# Altium schematic sheet Sheet1.SchDoc
size A; SheetNumber: 2; SheetTotal: 4
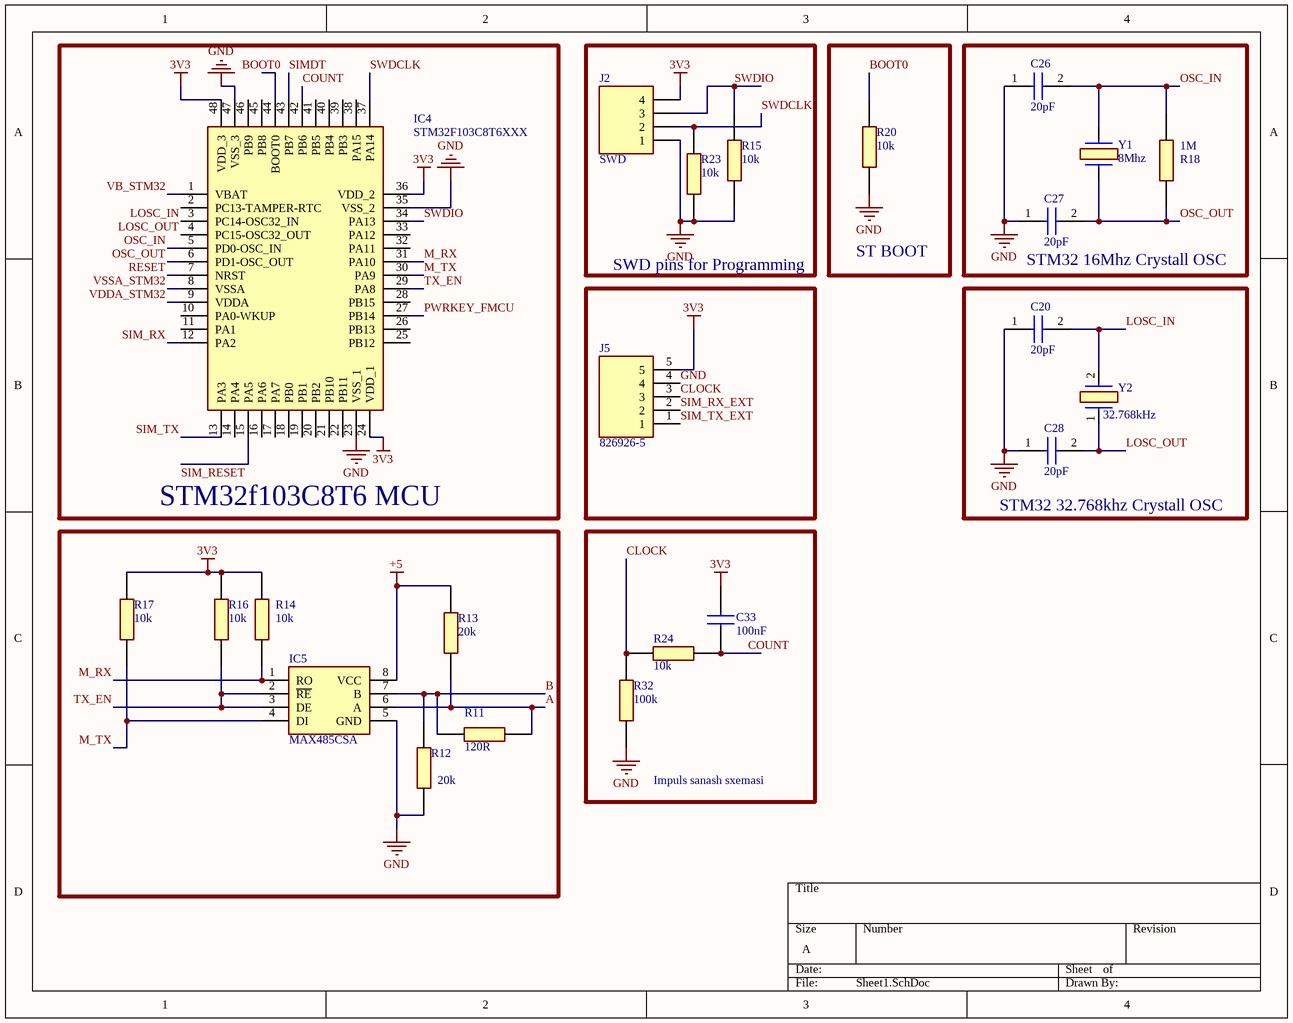
[diagram p0: Sheet1.SchDoc]

## Parts
C20  20pF  [C0603]
C26  20pF  [C0603]
C27  20pF  [C0603]
C28  20pF  [C0603]
C33  100nF  [CAPC1608X90N]
IC4  STM32F103C8T6XXX  [QFP50P900X900X160-48N]
IC5  MAX485CSA  [SOIC127P600X175-8N]
J2  SWD  [9298340704]
J5  826926-5  [HDRV5W85P0X254_1X5_1270X250X950P]
R11  120R  [RESC2012X60N]
R12  20k  [RESC2012X60N]
R13  20k  [RESC2012X60N]
R14  10k  [RESC2012X60N]
R15  10k  [RESC2012X60N]
R16  10k  [RESC2012X60N]
R17  10k  [RESC2012X60N]
R18  1M  [RESC1608X55N]
R20  10k  [RESC2012X60N]
R23  10k  [RESC2012X60N]
R24  10k  [RESC2012X60N]
R32  100k  [RESC2012X60N]
Y1  8Mhz  [830003151]
Y2  32.768kHz  [ABS06]

## Blocks framed on the sheet
SWD pins for Programming: J2 R15 R23
ST BOOT: R20
STM32 16Mhz Crystall OSC: C26 C27 R18 Y1
STM32 32.768khz Crystall OSC: C20 C28 Y2
STM32f103C8T6 MCU: IC5 R11-R14 R16 R17
Impuls sanash sxemasi: C33 R24 R32

## Nets
3V3: C33.2 IC4.24(VDD_1) IC4.36(VDD_2) IC4.48(VDD_3) J2.4 J5.5 R14.2 R16.2 R17.2
+5: IC5.8(VCC) R13.2
GND: C20.1 C26.1 C27.1 C28.1 IC4.23(VSS_1) IC4.35(VSS_2) IC4.47(VSS_3) IC5.5(GND) J2.1 J5.4 R12.1 R15.1 R20.1 R23.1 R32.1
A: IC5.6(A) R11.2 R13.1
B: IC5.7(B) R11.1 R12.2
BOOT0: IC4.44(BOOT0) R20.2
CLOCK: J5.3 R24.2 R32.2
COUNT: C33.1 IC4.42(PB6) R24.1
LOSC_IN: C20.2 IC4.3(PC14-OSC32_IN) Y2.2
LOSC_OUT: C28.2 IC4.4(PC15-OSC32_OUT) Y2.1
M_RX: IC4.31(PA10) IC5.1(RO) R14.1
M_TX: IC4.30(PA9) IC5.4(DI) R17.1
OSC_IN: C26.2 IC4.5(PD0-OSC_IN) R18.2 Y1.1
OSC_OUT: C27.2 IC4.6(PD1-OSC_OUT) R18.1 Y1.2
PWRKEY_FMCU: IC4.27(PB14)
RESET: IC4.7(NRST)
SIM_RESET: IC4.15(PA5)
SIM_RX: IC4.12(PA2)
SIM_RX_EXT: J5.2
SIM_TX: IC4.13(PA3)
SIM_TX_EXT: J5.1
SIMDT: IC4.43(PB7)
SWDCLK: IC4.37(PA14) J2.2 R23.2
SWDIO: IC4.34(PA13) J2.3 R15.2
TX_EN: IC4.29(PA8) IC5.2(~{RE}) IC5.3(DE) R16.1
VB_STM32: IC4.1(VBAT)
VDDA_STM32: IC4.9(VDDA)
VSSA_STM32: IC4.8(VSSA)

Not connected (* = marked no-connect by the designer): IC4 2(PC13-TAMPER-RTC) 10(PA0-WKUP) 11(PA1) 14(PA4) 16(PA6) 17(PA7) 18(PB0) 19(PB1) 20(PB2) 21(PB10) 22(PB11) 25(PB12) 26(PB13) 28(PB15) 32(PA11) 33(PA12) 38(PA15) 39(PB3) 40(PB4) 41(PB5) 45(PB8) 46(PB9)

## Library data of the parts
C20 C26-C28 = C0603C200G8HACTU: Capacitor; Manufacturer_Name: KEMET; Datasheet Link: https://content.kemet.com/datasheets/KEM_C1007_X8R_ULTRA_150C_SMD.pdf; Height: 0.87mm; Manufacturer_Part_Number: C0603C200G8HACTU; Mouser Part Number: 80-C0603C200G8HACTU; Mouser Price/Stock: https://www.mouser.co.uk/ProductDetail/KEMET/C0603C200G8HACTU?qs=W0yvOO0ixfFF9ypbpYI35Q%3D%3D
C33 = 06036C104MAZ2A: Capacitor; Manufacturer_Name: AVX; Datasheet Link: https://componentsearchengine.com/Datasheets/1/06031A100FAT2A.pdf; Height: 0.9mm; Manufacturer_Part_Number: 06036C104MAZ2A; Mouser Part Number: 581-06036C104MAZ2A; Mouser Price/Stock: https://www.mouser.co.uk/ProductDetail/AVX/06036C104MAZ2A?qs=9g9l2Gjnh0s%2FYval7p6%252B1g%3D%3D; Arrow Part Number: 06036C104MAZ2A; Arrow Price/Stock: https://www.arrow.com/en/products/06036c104maz2a/avx
IC4 = STM32F103C8T6XXX: Integrated Circuit; Manufacturer_Name: ST; Height: 1.6mm; Manufacturer_Part_Number: STM32F103C8T6XXX
IC5 = MAX485CSA: Integrated Circuit; Manufacturer_Name: Analog Devices; Datasheet Link: https://datasheets.maximintegrated.com/en/ds/MAX1487-MAX491.pdf; Height: 1.75mm; Manufacturer_Part_Number: MAX485CSA; Mouser Part Number: N/A; Mouser Price/Stock: https://www.mouser.co.uk/ProductDetail/Maxim-Integrated/MAX485CSA?qs=LHmEVA8xxfbb%2FSUlm%252BHF3Q%3D%3D
J2 = 929834-07-04: Connector; Manufacturer_Name: 3M; Datasheet Link: https://www.mouser.ca/datasheet/2/1/ts0769-35914.pdf; Height: 8.713mm; Manufacturer_Part_Number: 929834-07-04; Mouser Part Number: 517-929834-07-04; Mouser Price/Stock: https://www.mouser.com/Search/Refine.aspx?Keyword=517-929834-07-04
J5 = 826926-5: Connector; Manufacturer_Name: TE Connectivity; Datasheet Link: http://uk.rs-online.com/web/p/products/6695323; Height: 9.5mm; Manufacturer_Part_Number: 826926-5; Mouser Part Number: 571-826926-5; Mouser Price/Stock: https://www.mouser.co.uk/ProductDetail/TE-Connectivity/826926-5?qs=wMzmFFBcbXS4DfsolxXR2g%3D%3D; Arrow Part Number: 826926-5; Arrow Price/Stock: https://www.arrow.com/en/products/826926-5/te-connectivity?region=europe
R11 = CR0805-JW-121ELF: Resistor; Manufacturer_Name: Bourns; Datasheet Link: https://www.bourns.com/pdfs/chpreztr.pdf; Height: 0.6mm; Manufacturer_Part_Number: CR0805-JW-121ELF; Mouser Part Number: 652-CR0805JW-121ELF; Mouser Price/Stock: https://www.mouser.co.uk/ProductDetail/Bourns/CR0805-JW-121ELF?qs=wL7NMIHXUPnmcuStpLOKew%3D%3D; Arrow Part Number: CR0805-JW-121ELF; Arrow Price/Stock: https://www.arrow.com/en/products/cr0805-jw-121elf/bourns?region=nac
R12 R13 = CR0805-FX-2002ELF: Resistor; Manufacturer_Name: Bourns; Datasheet Link: https://www.bourns.com/pdfs/chpreztr.pdf; Height: 0.6mm; Manufacturer_Part_Number: CR0805-FX-2002ELF; Mouser Part Number: 652-CR0805FX-2002ELF; Mouser Price/Stock: https://www.mouser.co.uk/ProductDetail/Bourns/CR0805-FX-2002ELF?qs=mEbcl8R%252Bl%252Bv8rqM1zQjjRA%3D%3D; Arrow Part Number: CR0805-FX-2002ELF; Arrow Price/Stock: https://www.arrow.com/en/products/cr0805-fx-2002elf/bourns?region=nac
R14-R17 R20 R23 R24 = CR0805-FX-1002ELF: Resistor; Manufacturer_Name: Bourns; Datasheet Link: https://www.bourns.com/pdfs/chpreztr.pdf; Height: 0.6mm; Manufacturer_Part_Number: CR0805-FX-1002ELF; Mouser Part Number: 652-CR0805FX-1002ELF; Mouser Price/Stock: https://www.mouser.co.uk/ProductDetail/Bourns/CR0805-FX-1002ELF?qs=tknLyCMIRbPr%252BDD0s0nG9g%3D%3D; Arrow Part Number: CR0805-FX-1002ELF; Arrow Price/Stock: https://www.arrow.com/en/products/cr0805-fx-1002elf/bourns?region=nac
R18 = CR0603-FX-1004ELF: Resistor; Manufacturer_Name: Bourns; Datasheet Link: https://www.bourns.com/pdfs/chpreztr.pdf; Height: 0.55mm; Manufacturer_Part_Number: CR0603-FX-1004ELF; Mouser Part Number: 652-CR0603FX-1004ELF; Mouser Price/Stock: https://www.mouser.co.uk/ProductDetail/Bourns/CR0603-FX-1004ELF?qs=e7cxVwPieuqVG4NBrfqH%252BA%3D%3D; Arrow Part Number: CR0603-FX-1004ELF; Arrow Price/Stock: https://www.arrow.com/en/products/cr0603-fx-1004elf/bourns?region=nac
R32 = CR0805-FX-1003ELF: Resistor; Manufacturer_Name: Bourns; Datasheet Link: https://www.bourns.com/pdfs/chpreztr.pdf; Height: 0.6mm; Manufacturer_Part_Number: CR0805-FX-1003ELF; Mouser Part Number: 652-CR0805FX-1003ELF; Mouser Price/Stock: https://www.mouser.co.uk/ProductDetail/Bourns/CR0805-FX-1003ELF?qs=tknLyCMIRbPd3RvyRhvkuQ%3D%3D; Arrow Part Number: CR0805-FX-1003ELF; Arrow Price/Stock: https://www.arrow.com/en/products/cr0805-fx-1003elf/bourns?region=nac
Y1 = 830003151: Crystal or Oscillator; Manufacturer_Name: Wurth Elektronik; Datasheet Link: https://www.we-online.com/catalog/datasheet/830003151.pdf; Height: 4.3mm; Manufacturer_Part_Number: 830003151; Mouser Part Number: 710-830003151; Mouser Price/Stock: https://www.mouser.co.uk/ProductDetail/Wurth-Elektronik/830003151?qs=2WXlatMagcHisY7XHApyYg%3D%3D
Y2 = ABS06-127-32.768KHZ-T: Crystal or Oscillator; Manufacturer_Name: ABRACON; Datasheet Link: https://abracon.com/Resonators/ABS06.pdf; Height: 0.6mm; Manufacturer_Part_Number: ABS06-127-32.768KHZ-T; Mouser Part Number: 815-ABS0612732.768KT; Mouser Price/Stock: https://www.mouser.co.uk/ProductDetail/ABRACON/ABS06-127-32.768KHZ-T?qs=wUXugUrL1qxIf8zF6vMtIQ%3D%3D; Arrow Part Number: ABS06-127-32.768KHZ-T; Arrow Price/Stock: https://www.arrow.com/en/products/abs06-127-32.768khz-t/abracon?region=nac